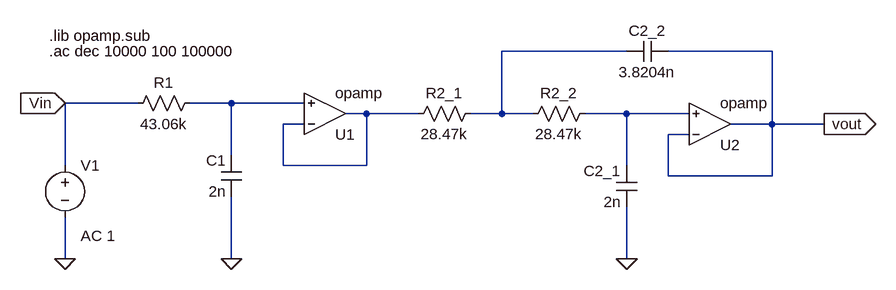
[diagram p0: schematic Bessel-Desnormalizado.asc]
Bessel-Desnormalizado.asc, the LTspice schematic file:
Version 4.1
SHEET 1 1200 680
WIRE 752 -144 560 -144
WIRE 976 -144 816 -144
WIRE 0 -64 -112 -64
WIRE 144 -64 80 -64
WIRE 256 -64 144 -64
WIRE 352 -48 320 -48
WIRE 432 -48 352 -48
WIRE 560 -48 560 -144
WIRE 560 -48 512 -48
WIRE 608 -48 560 -48
WIRE 752 -48 688 -48
WIRE 848 -48 752 -48
WIRE 256 -32 224 -32
WIRE 976 -32 976 -144
WIRE 976 -32 912 -32
WIRE 1056 -32 976 -32
WIRE 848 -16 816 -16
WIRE 144 16 144 -64
WIRE -112 32 -112 -64
WIRE 224 32 224 -32
WIRE 352 32 352 -48
WIRE 352 32 224 32
WIRE 752 32 752 -48
WIRE 816 48 816 -16
WIRE 976 48 976 -32
WIRE 976 48 816 48
WIRE -112 176 -112 112
WIRE 144 176 144 80
WIRE 752 176 752 96
FLAG -112 176 0
FLAG 144 176 0
FLAG 1056 -32 vout
IOPIN 1056 -32 Out
FLAG 752 176 0
FLAG -112 -64 Vin
IOPIN -112 -64 In
SYMBOL voltage -112 16 R0
WINDOW 123 24 124 Left 2
WINDOW 39 0 0 Left 0
SYMATTR Value2 AC 1
SYMATTR InstName V1
SYMATTR Value ""
SYMBOL cap 160 80 R180
WINDOW 0 24 56 Left 2
WINDOW 3 24 8 Left 2
SYMATTR InstName C1
SYMATTR Value 2n
SYMBOL res 96 -80 R90
WINDOW 0 0 56 VBottom 2
WINDOW 3 32 56 VTop 2
SYMATTR InstName R1
SYMATTR Value 43.06k
SYMBOL OpAmps\\opamp 288 16 M180
SYMATTR InstName U1
SYMBOL res 528 -64 R90
WINDOW 0 0 56 VBottom 2
WINDOW 3 32 56 VTop 2
SYMATTR InstName R2_1
SYMATTR Value 28.47k
SYMBOL res 704 -64 R90
WINDOW 0 0 56 VBottom 2
WINDOW 3 32 56 VTop 2
SYMATTR InstName R2_2
SYMATTR Value 28.47k
SYMBOL cap 816 -160 R90
WINDOW 0 0 32 VBottom 2
WINDOW 3 32 32 VTop 2
SYMATTR InstName C2_2
SYMATTR Value 3.8204n
SYMBOL cap 768 96 R180
WINDOW 0 24 56 Left 2
WINDOW 3 24 8 Left 2
SYMATTR InstName C2_1
SYMATTR Value 2n
SYMBOL OpAmps\\opamp 880 32 M180
SYMATTR InstName U2
TEXT -136 -168 Left 2 !.lib opamp.sub
TEXT -136 -144 Left 2 !.ac dec 10000 100 100000

The netlist it stands for:
* Bessel-Desnormalizado.asc
V1 Vin 0 AC 1
C1 0 N002 2n
R1 N002 Vin 43.06k
X§U1 N003 N002 N003 opamp Aol=100K GBW=10Meg  ; pins invin noninvin out
R2_1 N001 N003 28.47k
R2_2 N004 N001 28.47k
C2_2 vout N001 3.8204n
C2_1 0 N004 2n
X§U2 vout N004 vout opamp Aol=100K GBW=10Meg  ; pins invin noninvin out
.lib opamp.sub
.ac dec 10000 100 100000
.backanno
.end